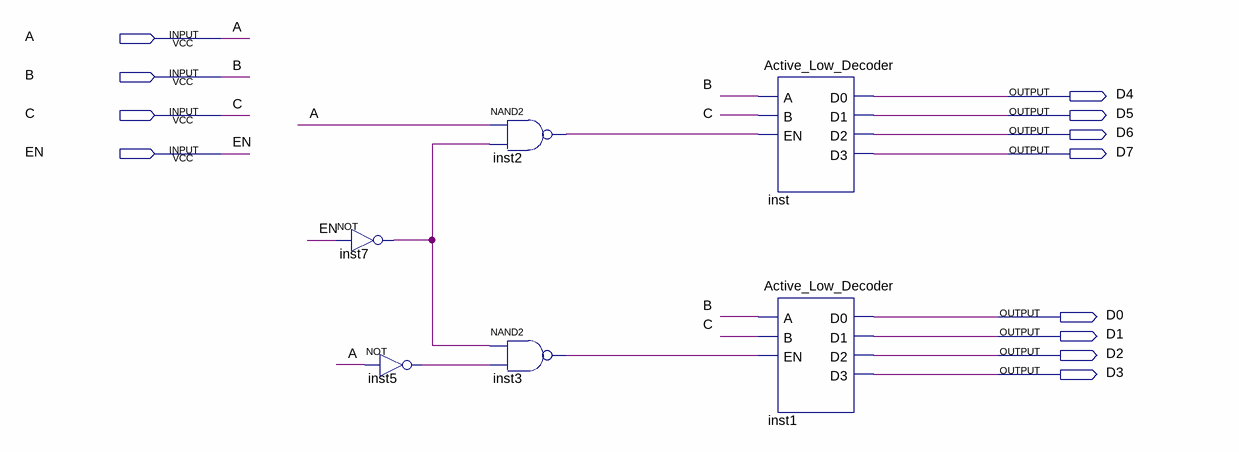
[diagram p0: schematic sheet]
// Quartus schematic Active_Low_3_to_8_Decoder.bdf as structural Verilog: 6 symbols, 12 pins
module Active_Low_3_to_8_Decoder (
  input  A,
  input  B,
  input  C,
  input  EN,
  output D4,
  output D5,
  output D6,
  output D7,
  output D0,
  output D1,
  output D2,
  output D3
);

  wire inst2_out, inst3_out, inst5_out, inst7_out;

  not inst7 (inst7_out, EN);
  not inst5 (inst5_out, A);
  nand inst2 (inst2_out, A, inst7_out);
  nand inst3 (inst3_out, inst7_out, inst5_out);
  Active_Low_Decoder inst (.A(B), .B(C), .EN(inst2_out), .D0(D4), .D1(D5), .D2(D6), .D3(D7));
  Active_Low_Decoder inst1 (.A(B), .B(C), .EN(inst3_out), .D0(D0), .D1(D1), .D2(D2), .D3(D3));
endmodule
